# Altium schematic sheet Warning_Light.SchDoc
size A
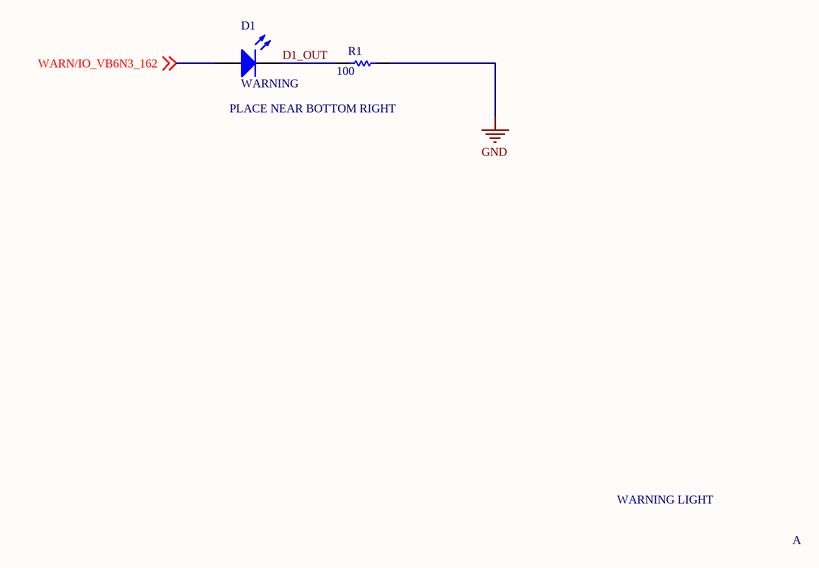
[diagram p0: Warning_Light.SchDoc]

## Parts
D1  WARNING  [DIODE_0603]
R1  value 100  [RES_0603]  (hidden comment: Figure out ohmage after RevA)

## Nets
GND: R1.2
D1_OUT: D1.2(K) R1.1
WARN/IO_VB6N3_162: D1.1(A) ; off-sheet WARN/IO_VB6N3_162

## Notes on the sheet
- PLACE NEAR BOTTOM RIGHT
- WARNING LIGHT
- A

## Library data of the parts
D1 = LED0: Typical INFRARED GaAs LED; Published: 8-Jun-2000; LatestRevisionDate: 08-Jul-2005; LatestRevisionNote: Mech Layer 1 removed.; PackageReference: LED-0; Publisher: Altium Limited; PackageDescription: LED; 2 Leads
R1 = Res1: Resistor; Published: 8-Jun-2000; LatestRevisionDate: 17-Jul-2002; LatestRevisionNote: Re-released for DXP Platform.; PackageReference: AXIAL-0.3; Publisher: Altium Limited; PackageDescription: Axial Device, Thru-Hole; 2 Leads; 0.3 in Pin Spacing